# Altium schematic sheet MotorCell_noPow.SchDoc
size A3; SheetNumber: 3
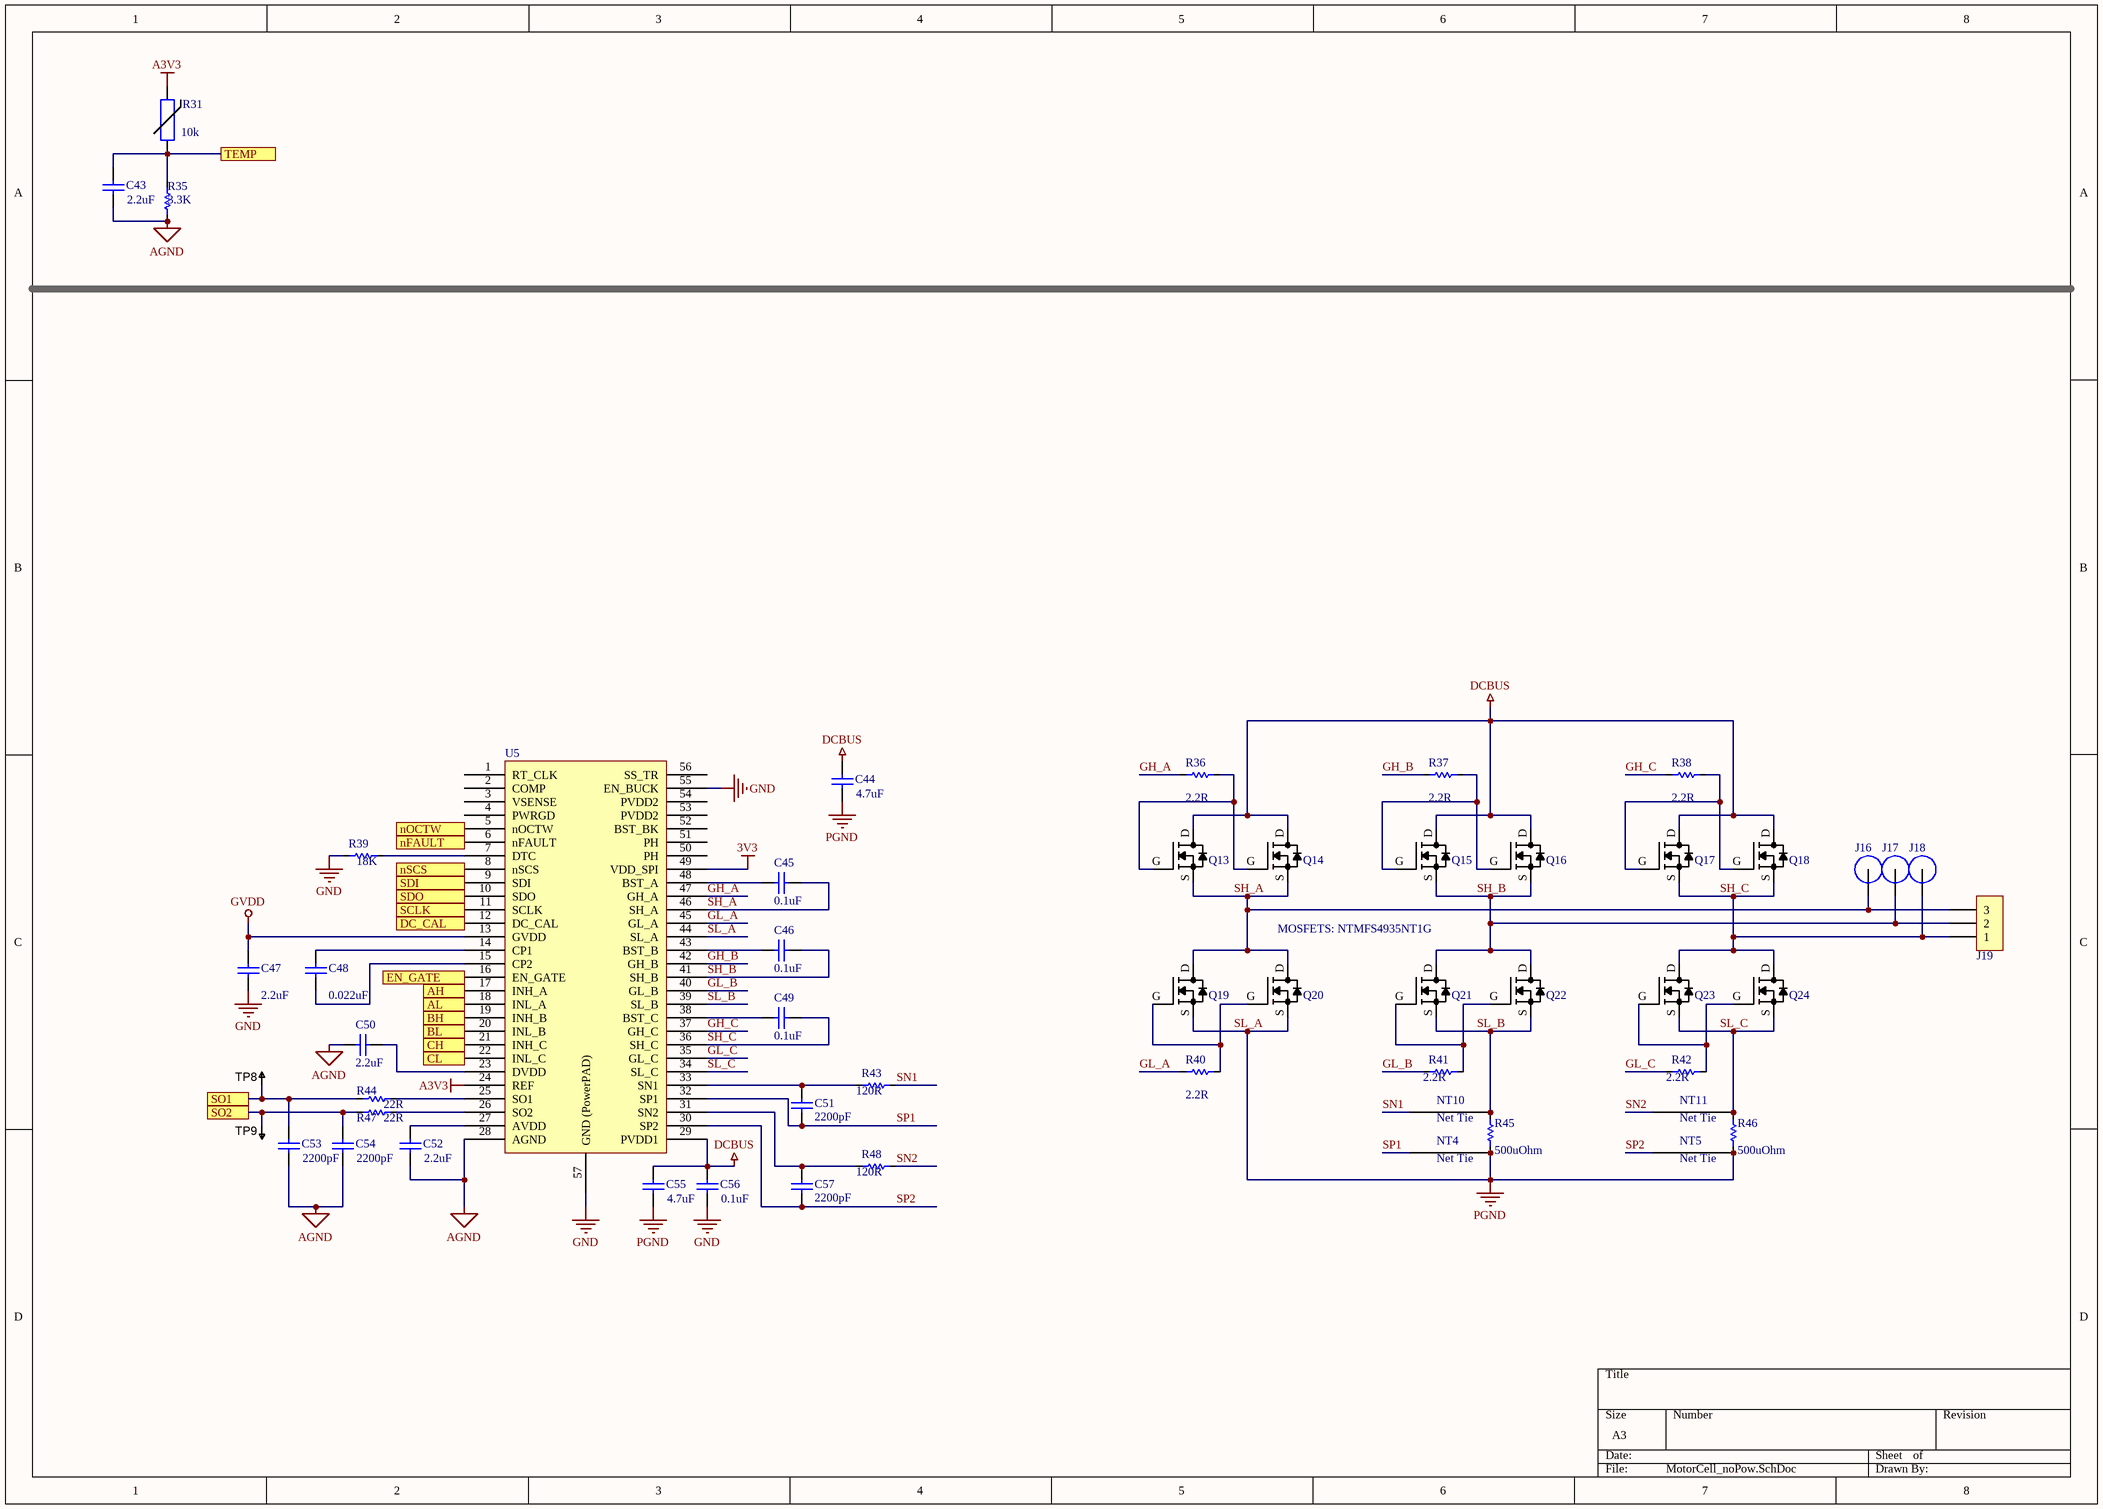
[diagram p0: MotorCell_noPow.SchDoc]

## Parts
C43  value 2.2uF  [C0603]  (hidden comment: Cap)
C44  value 4.7uF  [C0805]  (hidden comment: Cap)
C45  value 0.1uF  [C0603]  (hidden comment: Cap)
C46  value 0.1uF  [C0603]  (hidden comment: Cap)
C47  value 2.2uF  [C0603]  (hidden comment: Cap)
C48  value 0.022uF  [C0603]  (hidden comment: Cap)
C49  value 0.1uF  [C0603]  (hidden comment: Cap)
C50  value 2.2uF  [C0603]  (hidden comment: Cap)
C51  value 2200pF  [C0603]  (hidden comment: Cap)
C52  value 2.2uF  [C0603]  (hidden comment: Cap)
C53  value 2200pF  [C0603]  (hidden comment: Cap)
C54  value 2200pF  [C0603]  (hidden comment: Cap)
C55  value 4.7uF  [C0805]  (hidden comment: Cap)
C56  value 0.1uF  [C0603]  (hidden comment: Cap)
C57  value 2200pF  [C0603]  (hidden comment: Cap)
J16  (no value)  [M3 Spade Hole]
J17  (no value)  [M3 Spade Hole]
J18  (no value)  [M3 Spade Hole]
J19  1704936  [1704936]  (value not drawn)
NT4  0.25mm  [NetTie_0.25mm]  (value not drawn)  (net tie, no BOM)
NT5  0.25mm  [NetTie_0.25mm]  (value not drawn)  (net tie, no BOM)
NT10  0.25mm  [NetTie_0.25mm]  (value not drawn)  (net tie, no BOM)
NT11  0.25mm  [NetTie_0.25mm]  (value not drawn)  (net tie, no BOM)
Q13  (no value)  [SO8FL]
Q14  FILL_FOOTPRINT  [SO8FL_FILL]  (value not drawn)
Q15  (no value)  [SO8FL]
Q16  FILL_FOOTPRINT  [SO8FL_FILL]  (value not drawn)
Q17  (no value)  [SO8FL]
Q18  FILL_FOOTPRINT  [SO8FL_FILL]  (value not drawn)
Q19  (no value)  [SO8FL]
Q20  (no value)  [SO8FL]
Q21  (no value)  [SO8FL]
Q22  (no value)  [SO8FL]
Q23  (no value)  [SO8FL]
Q24  (no value)  [SO8FL]
R31  10k  [RESC1005X40N]
R35  value 3.3K  [R0603]  (hidden comment: Res)
R36  value 2.2R  [R0603]  (hidden comment: Res)
R37  value 2.2R  [R0603]  (hidden comment: Res)
R38  value 2.2R  [R0603]  (hidden comment: Res)
R39  value 18K  [R0603]  (hidden comment: Res)
R40  value 2.2R  [R0603]  (hidden comment: Res)
R41  value 2.2R  [R0603]  (hidden comment: Res)
R42  value 2.2R  [R0603]  (hidden comment: Res)
R43  value 120R  [R0603]  (hidden comment: Res)
R44  value 22R  [R0603]  (hidden comment: Res)
R45  value 500uOhm  [R2512]  (hidden comment: Res)
R46  value 500uOhm  [R2512]  (hidden comment: Res)
R47  value 22R  [R0603]  (hidden comment: Res)
R48  value 120R  [R0603]  (hidden comment: Res)
TP8  TESTPOINT  [TP-R30]  (value not drawn)  (no BOM)
TP9  TESTPOINT  [TP-R30]  (value not drawn)  (no BOM)
U5  (no value)  [TSSOP50P810X120_HS-57N]

## Ports
AH, AL, BH, BL, CH, CL, DC_CAL, EN_GATE, nFAULT, nOCTW, nSCS, SCLK, SDI, SDO, SO1, SO2, TEMP

## Nets
3V3: U5.49(VDD_SPI)
A3V3: R31.2 U5.24(REF)
AGND: C43.1 C50.2 C52.1 C53.1 C54.1 R35.1 U5.28(AGND)
DCBUS: C44.2 C55.2 C56.2 Q13.D Q14.D Q15.D Q16.D Q17.D Q18.D U5.29(PVDD1)
GND: C47.1 C56.1 R39.1 U5.55(EN_BUCK) U5.57(GND_(PowerPAD))
GVDD: C47.2 U5.13(GVDD)
SL_A: C44.1 C55.1 NT4.2 NT5.2 Q19.S Q20.S R45.1 R46.1 U5.44(SL_A)  [also labelled PGND]
AH: U5.17(INH_A) ; port AH
AL: U5.18(INL_A) ; port AL
BH: U5.19(INH_B) ; port BH
BL: U5.20(INL_B) ; port BL
CH: U5.21(INH_C) ; port CH
CL: U5.22(INL_C) ; port CL
DC_CAL: U5.12(DC_CAL) ; port DC_CAL
EN_GATE: U5.16(EN_GATE) ; port EN_GATE
GH_A: R36.2 U5.47(GH_A)
GH_B: R37.2 U5.42(GH_B)
GH_C: R38.2 U5.37(GH_C)
GL_A: R40.2 U5.45(GL_A)
GL_B: R41.2 U5.40(GL_B)
GL_C: R42.2 U5.35(GL_C)
nFAULT: U5.6(nFAULT) ; port nFAULT
nOCTW: U5.5(nOCTW) ; port nOCTW
nSCS: U5.8(nSCS) ; port nSCS
SCLK: U5.11(SCLK) ; port SCLK
SDI: U5.9(SDI) ; port SDI
SDO: U5.10(SDO) ; port SDO
SH_A: C45.1 J16.1 J19.3 Q13.S Q14.S Q19.D Q20.D U5.46(SH_A)
SH_B: C46.1 J17.1 J19.2 Q15.S Q16.S Q21.D Q22.D U5.41(SH_B)
SH_C: C49.1 J18.1 J19.1 Q17.S Q18.S Q23.D Q24.D U5.36(SH_C)
SL_B: NT10.2 Q21.S Q22.S R45.2 U5.39(SL_B)
SL_C: NT11.2 Q23.S Q24.S R46.2 U5.34(SL_C)
SN1: NT10.1 R43.2
SN2: NT11.1 R48.2
SO1: C53.2 R44.1 TP8.1 ; port SO1
SO2: C54.2 R47.1 TP9.1 ; port SO2
SP1: C51.2 NT4.1 U5.32(SP1)
SP2: C57.2 NT5.1 U5.30(SP2)
TEMP: C43.2 R31.1 R35.2 ; port TEMP
NetC45_2: C45.2 U5.48(BST_A)
NetC46_2: C46.2 U5.43(BST_B)
NetC48_1: C48.1 U5.15(CP2)
NetC48_2: C48.2 U5.14(CP1)
NetC49_2: C49.2 U5.38(BST_C)
NetC50_1: C50.1 U5.23(DVDD)
NetC51_1: C51.1 R43.1 U5.33(SN1)
NetC52_2: C52.2 U5.27(AVDD)
NetC57_1: C57.1 R48.1 U5.31(SN2)
NetQ13_G: Q13.G Q14.G R36.1
NetQ15_G: Q15.G Q16.G R37.1
NetQ17_G: Q17.G Q18.G R38.1
NetQ19_G: Q19.G Q20.G R40.1
NetQ21_G: Q21.G Q22.G R41.1
NetQ23_G: Q23.G Q24.G R42.1
NetR39_2: R39.2 U5.7(DTC)
NetR44_2: R44.2 U5.25(SO1)
NetR47_2: R47.2 U5.26(SO2)

Not connected (* = marked no-connect by the designer): U5 1(RT_CLK) 2(COMP) 3(VSENSE) 4(PWRGD) 50(PH) 51(PH) 52(BST_BK) 53(PVDD2) 54(PVDD2) 56(SS_TR)

## Notes on the sheet
- MOSFETS: NTMFS4935NT1G
- (in symbol NetTie_0.25mm) Net Tie

## Library data of the parts
C43 C44 C47 C50 = Cap: Capacitor; Published: 8-Jun-2000; LatestRevisionDate: 17-Jul-2002; LatestRevisionNote: Re-released for DXP Platform.; PackageReference: RAD-0.3; Publisher: Altium Limited; PackageDescription: Radial Cap, Thru-Hole; 2 Leads; 0.3 in Pin Spacing
C45 C46 C49 C56 = Cap: CAP CER 0.1UF 50V X7R 0603; Published: 8-Jun-2000; LatestRevisionDate: 17-Jul-2002; LatestRevisionNote: Re-released for DXP Platform.; PackageReference: RAD-0.3; Publisher: Altium Limited; PackageDescription: Radial Cap, Thru-Hole; 2 Leads; 0.3 in Pin Spacing
C48 = Cap: CAP CER 0.022UF 50V X7R 0603; Published: 8-Jun-2000; LatestRevisionDate: 17-Jul-2002; LatestRevisionNote: Re-released for DXP Platform.; PackageReference: RAD-0.3; Publisher: Altium Limited; PackageDescription: Radial Cap, Thru-Hole; 2 Leads; 0.3 in Pin Spacing
C51 C53 C54 C57 = Cap: CAP CER 2200PF 50V NP0 0603; Published: 8-Jun-2000; LatestRevisionDate: 17-Jul-2002; LatestRevisionNote: Re-released for DXP Platform.; PackageReference: RAD-0.3; Publisher: Altium Limited; PackageDescription: Radial Cap, Thru-Hole; 2 Leads; 0.3 in Pin Spacing
C52 = Cap: CAP CER 2.2UF 16V X5R 0603; Published: 8-Jun-2000; LatestRevisionDate: 17-Jul-2002; LatestRevisionNote: Re-released for DXP Platform.; PackageReference: RAD-0.3; Publisher: Altium Limited; PackageDescription: Radial Cap, Thru-Hole; 2 Leads; 0.3 in Pin Spacing
C55 = Cap: CAP CER 4.7UF 35V X5R 0805; Published: 8-Jun-2000; LatestRevisionDate: 17-Jul-2002; LatestRevisionNote: Re-released for DXP Platform.; PackageReference: RAD-0.3; Publisher: Altium Limited; PackageDescription: Radial Cap, Thru-Hole; 2 Leads; 0.3 in Pin Spacing
J16-J18 = M3 Spade Terminal
J19 = 1704936: CONN TERM BLOCK 3POS 7.62MM; Manufacturer: Phoenix Contact; Number of Levels: 1; Positions Per Level: 3; Pitch: 0.300" (7.62mm); Mating Orientation: Horizontal with Board; Current: 30A; Voltage: 300V; Wire Gauge: 10-30 AWG; Wire Termination: Screw - Rising Cage Clamp; Torque - Screw: 0.5-0.6 Nm (4.4-5.3 Lb-In); Screw Thread: M3; Supplier 1: Digi-Key; Supplier Part Number 1: 277-5954-ND; RoHS: RoHS Compliant; Category: Connectors, Interconnects; Stock: 3559; Pricing 1: 1=2.19, 10=2.128, 50=1.989, 100=1.8299, 250=1.69064, 500=1.61108, 1000=1.482 (USD); Packaging: Bulk; Part Status: Active; Mounting Type: Through Hole; Features: Interlocking (Side); Color: Green; Operating Temperature: -; Housing Material: Polyamide (PA), Nylon; Contact Material - Plating: -; Clamp Material - Plating: -; Screw Material - Plating: -; ComponentLink1URL: http://media.digikey.com/PDF/Data%20Sheets/Phoenix%20Contact%20PDFs/1704936.pdf; ComponentLink1Description: http://media.digikey.com/PDF/Data%20Sheets/Phoenix%20Contact%20PDFs/1704936.pdf; Manufacturer Part Number: 1704936
NT4 NT5 NT10 NT11 = NetTie_0.25mm
Q13-Q24 = NTMFS4935NT1G: MOSFET N-CH 30V 13A SO8FL; Manufacturer: ON Semiconductor; FET Type: N-Channel; Current - Continuous Drain (Id) @ 25°C: 13A (Ta), 93A (Tc); Drive Voltage (Max Rds On,  Min Rds On): 4.5V, 10V; Vgs(th) (Max) @ Id: 2.2V @ 250µA; Gate Charge (Qg) (Max) @ Vgs: 49.4nC @ 10V; Input Capacitance (Ciss) (Max) @ Vds: 4850pF @ 15V; Vgs (Max): ±20V; Power Dissipation (Max): 930mW (Ta), 48W (Tc); Rds On (Max) @ Id, Vgs: 3.2 mOhm @ 30A, 10V; Supplier 1: Digi-Key; Supplier Part Number 1: NTMFS4935NT1GOSCT-ND; RoHS: RoHS Compliant; Category: Discrete Semiconductor Products; Stock 1: 932; Pricing 1: 1=0.61, 10=0.541, 100=0.4145, 500=0.3277 (USD); Packaging: Cut Tape (CT); Part Status: Active; Technology: MOSFET (Metal Oxide); Drain to Source Voltage (Vdss): 30V; FET Feature: -; Operating Temperature: -55°C ~ 150°C (TJ); Mounting Type: Surface Mount; Supplier Device Package: 5-DFN (5x6) (8-SOFL); Package / Case: 8-PowerTDFN, 5 Leads; ComponentLink1URL: http://www.onsemi.com/pub_link/Collateral/NTMFS4935N-D.PDF; ComponentLink1Description: http://www.onsemi.com/pub_link/Collateral/NTMFS4935N-D.PDF; Manufacturer Part Number: NTMFS4935NT1G
R31 = NCP15XH103F03RC: THERMISTOR 10K OHM NTC 0402 SMD; Value: 10k
R35-R44 R47 R48 = Res: Resistor; Published: 8-Jun-2000; LatestRevisionDate: 17-Jul-2002; LatestRevisionNote: Re-released for DXP Platform.; PackageReference: AXIAL-0.3; Publisher: Altium Limited; PackageDescription: Axial Device, Thru-Hole; 2 Leads; 0.3 in Pin Spacing
R45 R46 = Res: RES SMD 0.0005 OHM 1% 3W 2512; Published: 8-Jun-2000; LatestRevisionDate: 17-Jul-2002; LatestRevisionNote: Re-released for DXP Platform.; PackageReference: AXIAL-0.3; Publisher: Altium Limited; PackageDescription: Axial Device, Thru-Hole; 2 Leads; 0.3 in Pin Spacing
TP8 TP9 = TESTPOINT: SMD test pin
U5 = DRV8301: MOTOR DRIVER, 3PH, 56HTSSOP